# Altium project AVR32DA48_DEwheel2.PrjPcb
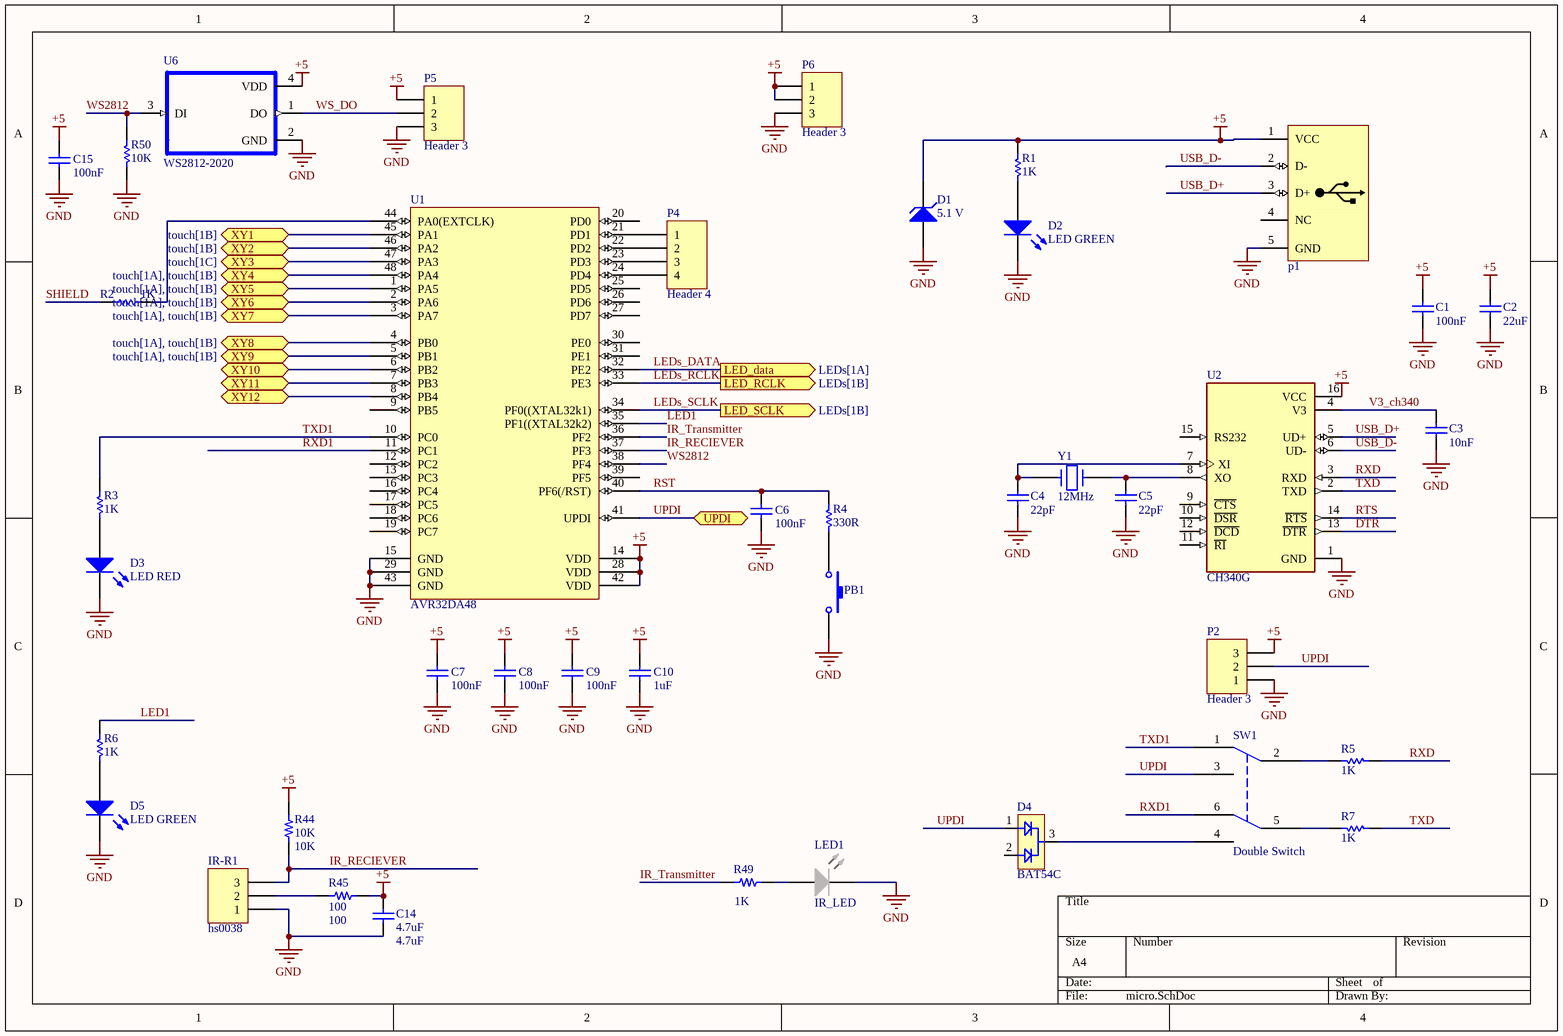
[diagram p0: micro.SchDoc]
3 sheets, 115 parts. Net scope: flat (ports and power ports of the same name join across sheets).
Board file: QTouch_test2.PcbDoc
Sheets:
  micro.SchDoc
  touch.SchDoc
  LEDs.SchDoc

## Sheet micro.SchDoc
size A4; SheetNumber: 1; SheetTotal: 3

### Parts
C1  100nF  [SMD_CAP_0805]
C2  22uF  [SMD_CAP_0805]
C3  10nF  [SMD_CAP_0805]
C4  22pF  [SMD_CAP_0805]
C5  22pF  [SMD_CAP_0805]
C6  value 100nF  [CAP0805]  (hidden comment: cap 100nF)
C7  value 100nF  [CAP0805]  (hidden comment: cap 100nF)
C8  value 100nF  [CAP0805]  (hidden comment: cap 100nF)
C9  value 100nF  [CAP0805]  (hidden comment: cap 100nF)
C10  value 1uF  [CAP0805]  (hidden comment: cap 1uF)
C14  4.7uF  [CAP0805]
C15  value 100nF  [CAP0805]  (hidden comment: cap 100nF)
D1  Voltage: 5.1 V  [Diode 1n4148 SMD]  (hidden comment: Diode Zener)
D2  LED GREEN  [LED_0805 G]
D3  LED RED  [LED_0805 G]
D4  BAT54C  [SOT-23]
D5  LED GREEN  [LED_0805 G]
IR-R1  hs0038  [HS3800B]
LED1  IR_LED  [LED_WHITE]
p1  USB Connector  [USB_AB_BM_SHS]  (value not drawn)
P2  Header 3  [HDR1X3]
P4  Header 4  [HDR1X4]
P5  Header 3  [HDR1X3]
P6  Header 3  [HDR1X3]
PB1  Push-Button-tall  [tack-sw-3x5x6]  (value not drawn)
R1  value 1K  [RES0805]  (hidden comment: Res 1K)
R2  1K  [RES 0805 (2012X06L)]
R3  value 1K  [RES0805]  (hidden comment: Res 1K)
R4  value 330R  [RES0805]  (hidden comment: Res 330R)
R5  value 1K  [RES0805]  (hidden comment: Res 1K)
R6  value 1K  [RES0805]  (hidden comment: Res 1K)
R7  value 1K  [RES0805]  (hidden comment: Res 1K)
R44  10K  [RES0805]
R45  100  [RES0805]
R49  1K  [RES0805]
R50  value 10K  [RES0805]  (hidden comment: Res 10K)
SW1  Double Switch  [switch_2way_DPDT_right]
U1  AVR32DA48  [TQPF48]
U2  CH340G  [SOIC16_N]
U6  WS2812-2020  [LED_WS2812B-5050]
Y1  12MHz  [XTAL_SMD]

### Ports
LED_data (out, see LEDs[1A]), LED_RCLK (out, see LEDs[1B]), LED_SCLK (out, see LEDs[1B]), UPDI (bidir), XY1 (bidir, see touch[1B]), XY2 (bidir, see touch[1B]), XY3 (bidir, see touch[1C]), XY4 (bidir, see touch[1A], touch[1B]), XY5 (bidir, see touch[1A], touch[1B]), XY6 (bidir, see touch[1A], touch[1B]), XY7 (bidir, see touch[1A], touch[1B]), XY8 (bidir, see touch[1A], touch[1B]), XY9 (bidir, see touch[1A], touch[1B]), XY10 (bidir), XY11 (bidir), XY12 (bidir)

### Nets
+5: C1.2 C2.2 C7.2 C8.2 C9.2 C10.2 C14.2 C15.2 D1.2(K) p1.1(VCC) P2.3 P5.1 P6.1 P6.2 R1.1 R44.1 R45.1 U1.14(VDD) U1.28(VDD) U1.42(VDD) U2.16(VCC) U6.4(VDD)
GND: C1.1 C2.1 C3.1 C4.1 C5.1 C6.1 C7.1 C8.1 C9.1 C10.1 C14.1 C15.1 D1.1(A) D2.2(K) D3.2(K) D5.2(K) IR-R1.1 LED1.K p1.5(GND) P2.1 P5.3 P6.3 PB1.1 R50.2 U1.15(GND) U1.29(GND) U1.43(GND) U2.1(GND) U6.2(GND)
DTR: U2.13(~{DTR})
IR_RECIEVER: IR-R1.3 R44.2 U1.37(PF3)
IR_Transmitter: R49.2 U1.36(PF2)
LED1: R6.1 U1.35(PF1((XTAL32k2))
LEDs_DATA: U1.32(PE2) ; port LED_data
LEDs_RCLK: U1.33(PE3) ; port LED_RCLK
LEDs_SCLK: U1.34(PF0((XTAL32k1)) ; port LED_SCLK
RST: C6.2 R4.1 U1.40(PF6(/RST))
RTS: U2.14(~{RTS})
RXD: R5.2 U2.3(RXD)
RXD1: SW1.6 U1.11(PC1)
SHIELD: R2.2
TXD: R7.2 U2.2(TXD)
TXD1: R3.1 SW1.1 U1.10(PC0)
UPDI: D4.1 P2.2 SW1.3 U1.41(UPDI) ; port UPDI
USB_D+: p1.3(D+) U2.5(UD+)
USB_D-: p1.2(D-) U2.6(UD-)
V3_ch340: C3.2 U2.4(V3)
WS2812: R50.1 U1.38(PF4) U6.3(DI)
WS_DO: P5.2 U6.1(DO)
NetC4_2: C4.2 U2.7(XI) Y1.1
NetC5_2: C5.2 U2.8(XO) Y1.2
NetD2_1: D2.1(A) R1.2
NetD3_1: D3.1(A) R3.2
NetD4_3: D4.3 SW1.4
NetD5_1: D5.1(A) R6.2
NetIR-R1_2: IR-R1.2 R45.2
NetLED1_A: LED1.A R49.1
NetP4_1: P4.1 U1.21(PD1)
NetP4_2: P4.2 U1.22(PD2)
NetP4_3: P4.3 U1.23(PD3)
NetP4_4: P4.4 U1.24(PD4)
NetPB1_2: PB1.2 R4.2
NetR2_1: R2.1 U1.44(PA0(EXTCLK))
NetR5_1: R5.1 SW1.2
NetR7_1: R7.1 SW1.5
NetR8_2: U1.48(PA4) ; port XY4
NetR9_2: U1.1(PA5) ; port XY5
NetR10_2: U1.2(PA6) ; port XY6
NetR11_2: U1.5(PB1) ; port XY9
NetR12_2: U1.4(PB0) ; port XY8
NetR13_2: U1.3(PA7) ; port XY7
NetR46_2: U1.45(PA1) ; port XY1
NetR47_2: U1.46(PA2) ; port XY2
NetR48_2: U1.47(PA3) ; port XY3
NetU1_6: U1.6(PB2) ; port XY10
NetU1_7: U1.7(PB3) ; port XY11
NetU1_8: U1.8(PB4) ; port XY12

Not connected (* = marked no-connect by the designer): D4 2; p1 4(NC); U1 9(PB5) 12(PC2) 13(PC3) 16(PC4) 17(PC5) 18(PC6) 19(PC7) 20(PD0) 25(PD5) 26(PD6) 27(PD7) 30(PE0) 31(PE1) 39(PF5); U2 9(~{CTS}) 10(~{DSR}) 11(~{RI}) 12(~{DCD}) 15(RS232)

### Library data of the parts
C1-C5 = Cap: CAP SMD 0805; Published: 8-Jun-2000; LatestRevisionDate: 17-Jul-2002; LatestRevisionNote: Re-released for DXP Platform.; PackageReference: RAD-0.3; Publisher: Altium Limited; PackageDescription: Radial Cap, Thru-Hole; 2 Leads; 0.3 in Pin Spacing
  C1: Value: 100nF
  C2: Value: 22uF
  C3: Value: 10nF
  C4 C5: Value: 22pF
C6-C10 C15 = Cap ceramic: CAP seramic
C14 = Cap: CAP SMD 0603; Published: 8-Jun-2000; LatestRevisionDate: 17-Jul-2002; LatestRevisionNote: Re-released for DXP Platform.; PackageReference: RAD-0.3; Publisher: Altium Limited; PackageDescription: Radial Cap, Thru-Hole; 2 Leads; 0.3 in Pin Spacing; Value: 4.7uF
D1 = Diode Zener: Zener Diode; Designer: Saeid Jorablo; Company: E.P.I.L; Design Date: 2011/11/02
D2 D5 = LED0: LED SMD 0805 GREEN; Published: 8-Jun-2000; LatestRevisionDate: 08-Jul-2005; LatestRevisionNote: Mech Layer 1 removed.; PackageReference: LED-0; Publisher: Altium Limited; PackageDescription: LED; 2 Leads
D3 = LED0: LED SMD 0805 RED; Published: 8-Jun-2000; LatestRevisionDate: 08-Jul-2005; LatestRevisionNote: Mech Layer 1 removed.; PackageReference: LED-0; Publisher: Altium Limited; PackageDescription: LED; 2 Leads
IR-R1 = Header 3H: Header, 3-Pin, Right Angle; LatestRevisionDate: 17-Jul-2002; LatestRevisionNote: Re-released for DXP Platform.; Publisher: Altium Limited
LED1 = LED-W
p1 = USB MICRO: USB Connector MICRO-B Type; Designer: ABBAS BASEREH; Max Current: 1600mA; Mounting Technology: Surface Mount\Through-Hole; Category: Connector; Pin Count: 5-7; Publisher: ABBAS BASEREH; Status: Unreleased; ComponentLink1Description: Datasheet; ComponentLink2Description: Reference; Update: 1395-11-17
P2 P5 P6 = Header 3: Header, 3-Pin; LatestRevisionDate: 17-Jul-2002; LatestRevisionNote: Re-released for DXP Platform.; Publisher: Altium Limited
P4 = Header 4: Header, 4-Pin; LatestRevisionDate: 17-Jul-2002; LatestRevisionNote: Re-released for DXP Platform.; Publisher: Altium Limited
R1-R7 R50 = Res1: Resistor; Published: 8-Jun-2000; LatestRevisionDate: 17-Jul-2002; LatestRevisionNote: Re-released for DXP Platform.; PackageReference: AXIAL-0.3; Publisher: Altium Limited; PackageDescription: Axial Device, Thru-Hole; 2 Leads; 0.3 in Pin Spacing
  R2: Value: 1K
R44 R45 R49 = Resistor: RES SMD 0603; Part Number: RCS0805100KFKEA
  R44: Value: 10K
  R45: Value: 100
  R49: Value: 1K
SW1 = Switch - DPDT: DPDT Switch
U2 = CH340G: USB Interface Integrated Circuit; MF: WCH; Price: None; SnapEDA_Link: https://www.snapeda.com/parts/Ch340G/WCH/view-part/?ref=snap; MP: Ch340G; Value: *; Availability: Not in stock; Package: None; Check_prices: https://www.snapeda.com/parts/Ch340G/WCH/view-part/?ref=eda
U6 = WS2812-2020: Intelligent control LED integrated light source; MF: Worldsemi; SnapEDA_Link: https://www.snapeda.com/parts/WS2812-2020/Worldsemi/view-part/2873751/?ref=snap; Package: Package Analog Devices; MP: WS2812-2020; Value: *; Availability: Unavailable; Price: None
Y1 = CRYSTAL

## Sheet touch.SchDoc
size A4; SheetNumber: 2; SheetTotal: 3
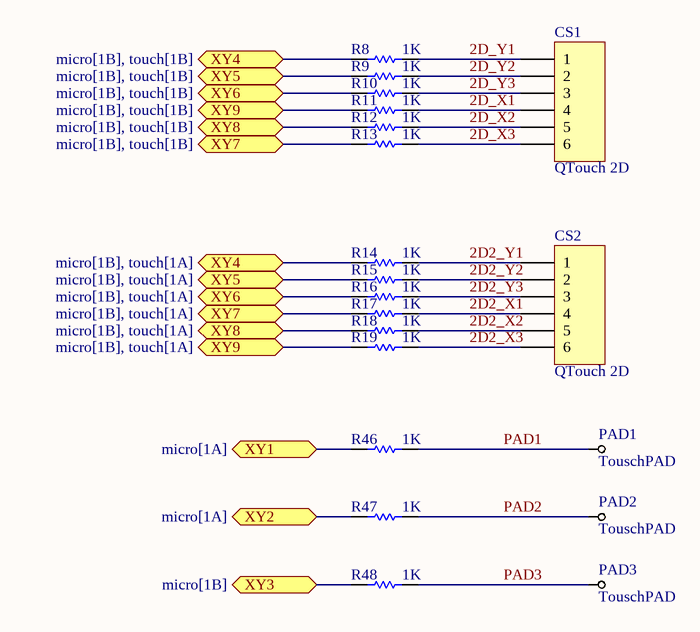
[diagram p1: touch.SchDoc]

### Parts
CS1  QTouch 2D  [wheel]
CS2  QTouch 2D  [2D_touch _wheel]
PAD1  TouschPAD  [touchpad7]  (no BOM)
PAD2  TouschPAD  [touchpad7]  (no BOM)
PAD3  TouschPAD  [touchpad7]  (no BOM)
R8  1K  [RES 0805 (2012X06L)]
R9  1K  [RES 0805 (2012X06L)]
R10  1K  [RES 0805 (2012X06L)]
R11  1K  [RES 0805 (2012X06L)]
R12  1K  [RES 0805 (2012X06L)]
R13  1K  [RES 0805 (2012X06L)]
R14  1K  [RES 0805 (2012X06L)]
R15  1K  [RES 0805 (2012X06L)]
R16  1K  [RES 0805 (2012X06L)]
R17  1K  [RES 0805 (2012X06L)]
R18  1K  [RES 0805 (2012X06L)]
R19  1K  [RES 0805 (2012X06L)]
R46  1K  [RES 0805 (2012X06L)]
R47  1K  [RES 0805 (2012X06L)]
R48  1K  [RES 0805 (2012X06L)]

### Ports
XY1 (bidir, see micro[1A]), XY2 (bidir, see micro[1A]), XY3 (bidir, see micro[1B]), XY4 (bidir, see micro[1B], touch[1A]), XY4 (bidir, see micro[1B], touch[1B]), XY5 (bidir, see micro[1B], touch[1A]), XY5 (bidir, see micro[1B], touch[1B]), XY6 (bidir, see micro[1B], touch[1A]), XY6 (bidir, see micro[1B], touch[1B]), XY7 (bidir, see micro[1B], touch[1A]), XY7 (bidir, see micro[1B], touch[1B]), XY8 (bidir, see micro[1B], touch[1A]), XY8 (bidir, see micro[1B], touch[1B]), XY9 (bidir, see micro[1B], touch[1A]), XY9 (bidir, see micro[1B], touch[1B])

### Nets
2D2_X1: CS2.4 R17.1
2D2_X2: CS2.5 R18.1
2D2_X3: CS2.6 R19.1
2D2_Y1: CS2.1 R14.1
2D2_Y2: CS2.2 R15.1
2D2_Y3: CS2.3 R16.1
2D_X1: CS1.4 R11.1
2D_X2: CS1.5 R12.1
2D_X3: CS1.6 R13.1
2D_Y1: CS1.1 R8.1
2D_Y2: CS1.2 R9.1
2D_Y3: CS1.3 R10.1
PAD1: PAD1.1(T) R46.1
PAD2: PAD2.1(T) R47.1
PAD3: PAD3.1(T) R48.1
NetR8_2: R8.2 R14.2 ; port XY4
NetR9_2: R9.2 R15.2 ; port XY5
NetR10_2: R10.2 R16.2 ; port XY6
NetR11_2: R11.2 R19.2 ; port XY9
NetR12_2: R12.2 R18.2 ; port XY8
NetR13_2: R13.2 R17.2 ; port XY7
NetR46_2: R46.2 ; port XY1
NetR47_2: R47.2 ; port XY2
NetR48_2: R48.2 ; port XY3

### Library data of the parts
CS1 CS2 = Header 6: 3 by 3 2D touch surface; LatestRevisionDate: 17-Jul-2002; LatestRevisionNote: Re-released for DXP Platform.; Publisher: Altium Limited
PAD1-PAD3 = Test Point
R8-R19 R46-R48 = Res1: Resistor; Published: 8-Jun-2000; LatestRevisionDate: 17-Jul-2002; LatestRevisionNote: Re-released for DXP Platform.; PackageReference: AXIAL-0.3; Publisher: Altium Limited; PackageDescription: Axial Device, Thru-Hole; 2 Leads; 0.3 in Pin Spacing; Value: 1K

## Sheet LEDs.SchDoc
size A4; SheetNumber: 3; SheetTotal: 3
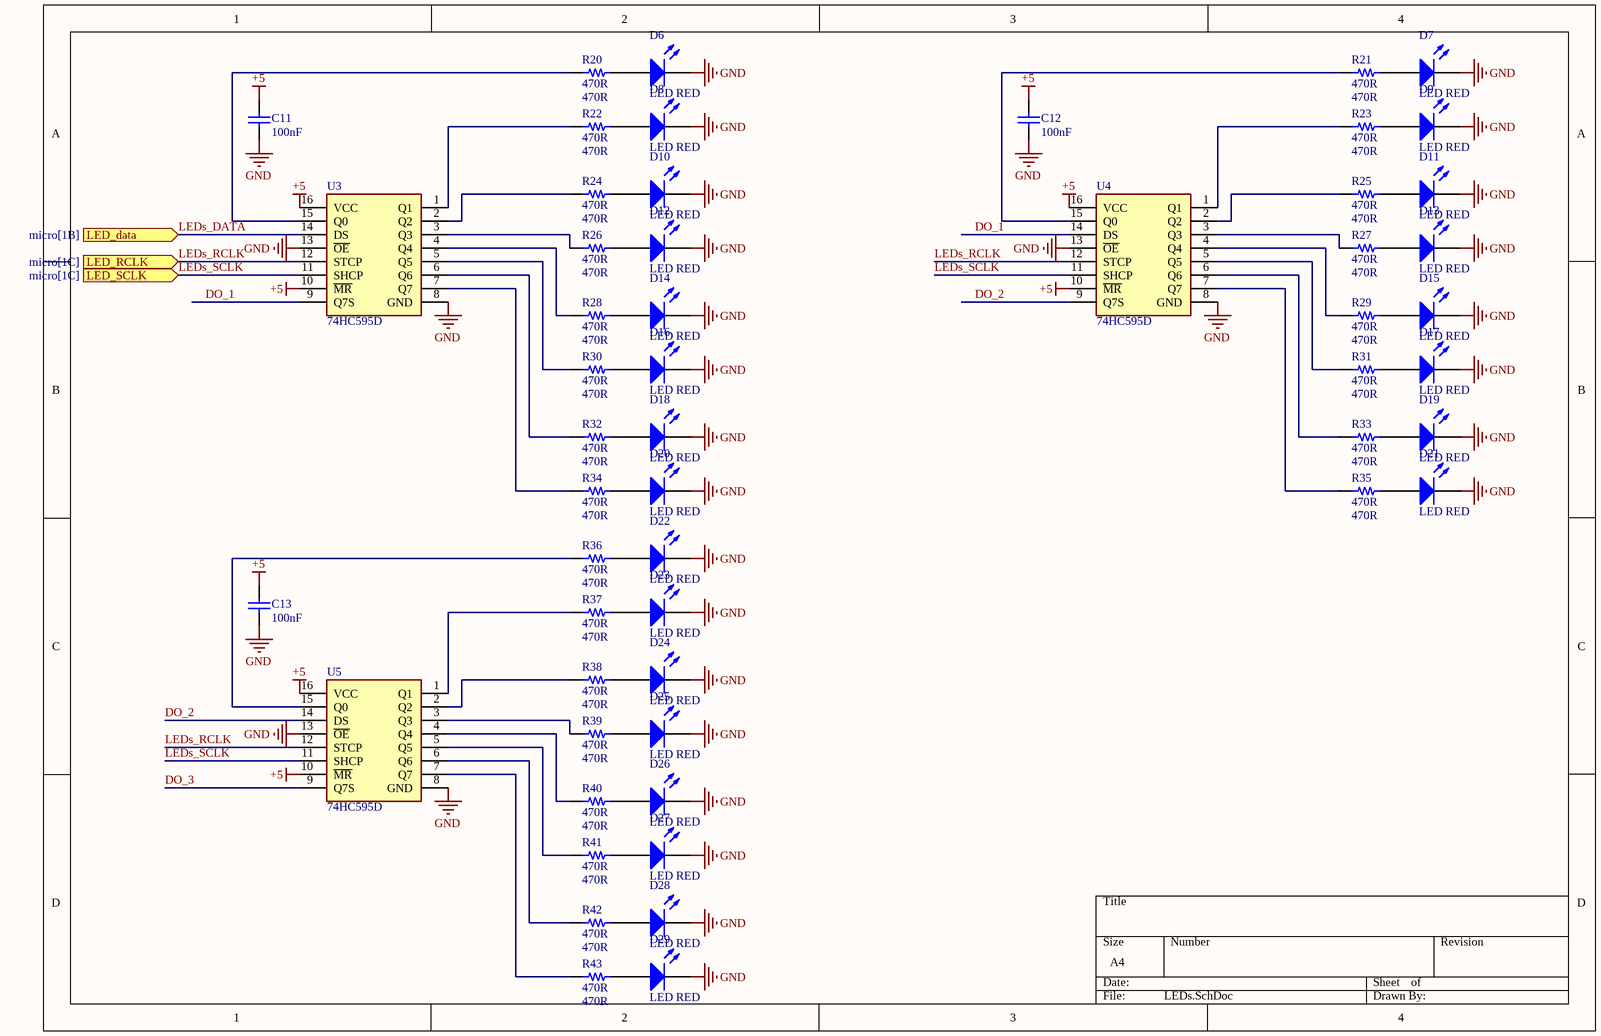
[diagram p2: LEDs.SchDoc]

### Parts
C11  100nF  [SMD_CAP_0805]
C12  100nF  [SMD_CAP_0805]
C13  100nF  [SMD_CAP_0805]
D6  LED RED  [LED_0805 G]
D7  LED RED  [LED_0805 G]
D8  LED RED  [LED_0805 G]
D9  LED RED  [LED_0805 G]
D10  LED RED  [LED_0805 G]
D11  LED RED  [LED_0805 G]
D12  LED RED  [LED_0805 G]
D13  LED RED  [LED_0805 G]
D14  LED RED  [LED_0805 G]
D15  LED RED  [LED_0805 G]
D16  LED RED  [LED_0805 G]
D17  LED RED  [LED_0805 G]
D18  LED RED  [LED_0805 G]
D19  LED RED  [LED_0805 G]
D20  LED RED  [LED_0805 G]
D21  LED RED  [LED_0805 G]
D22  LED RED  [LED_0805 G]
D23  LED RED  [LED_0805 G]
D24  LED RED  [LED_0805 G]
D25  LED RED  [LED_0805 G]
D26  LED RED  [LED_0805 G]
D27  LED RED  [LED_0805 G]
D28  LED RED  [LED_0805 G]
D29  LED RED  [LED_0805 G]
R20  470R  [RES0805]
R21  470R  [RES0805]
R22  470R  [RES0805]
R23  470R  [RES0805]
R24  470R  [RES0805]
R25  470R  [RES0805]
R26  470R  [RES0805]
R27  470R  [RES0805]
R28  470R  [RES0805]
R29  470R  [RES0805]
R30  470R  [RES0805]
R31  470R  [RES0805]
R32  470R  [RES0805]
R33  470R  [RES0805]
R34  470R  [RES0805]
R35  470R  [RES0805]
R36  470R  [RES0805]
R37  470R  [RES0805]
R38  470R  [RES0805]
R39  470R  [RES0805]
R40  470R  [RES0805]
R41  470R  [RES0805]
R42  470R  [RES0805]
R43  470R  [RES0805]
U3  74HC595D  [SOIC127P600X175-16N]
U4  74HC595D  [SOIC127P600X175-16N]
U5  74HC595D  [SOIC127P600X175-16N]

### Ports
LED_data (in, see micro[1B]), LED_RCLK (in, see micro[1C]), LED_SCLK (in, see micro[1C])

### Nets
+5: C11.2 C12.2 C13.2 U3.10(~{MR}) U3.16(VCC) U4.10(~{MR}) U4.16(VCC) U5.10(~{MR}) U5.16(VCC)
GND: C11.1 C12.1 C13.1 D6.2(K) D7.2(K) D8.2(K) D9.2(K) D10.2(K) D11.2(K) D12.2(K) D13.2(K) D14.2(K) D15.2(K) D16.2(K) D17.2(K) D18.2(K) D19.2(K) D20.2(K) D21.2(K) D22.2(K) D23.2(K) D24.2(K) D25.2(K) D26.2(K) D27.2(K) D28.2(K) D29.2(K) U3.8(GND) U3.13(~{OE}) U4.8(GND) U4.13(~{OE}) U5.8(GND) U5.13(~{OE})
DO_1: U3.9(Q7S) U4.14(DS)
DO_2: U4.9(Q7S) U5.14(DS)
DO_3: U5.9(Q7S)
LEDs_DATA: U3.14(DS) ; port LED_data
LEDs_RCLK: U3.12(STCP) U4.12(STCP) U5.12(STCP) ; port LED_RCLK
LEDs_SCLK: U3.11(SHCP) U4.11(SHCP) U5.11(SHCP) ; port LED_SCLK
NetD6_1: D6.1(A) R20.1
NetD7_1: D7.1(A) R21.1
NetD8_1: D8.1(A) R22.1
NetD9_1: D9.1(A) R23.1
NetD10_1: D10.1(A) R24.1
NetD11_1: D11.1(A) R25.1
NetD12_1: D12.1(A) R26.1
NetD13_1: D13.1(A) R27.1
NetD14_1: D14.1(A) R28.1
NetD15_1: D15.1(A) R29.1
NetD16_1: D16.1(A) R30.1
NetD17_1: D17.1(A) R31.1
NetD18_1: D18.1(A) R32.1
NetD19_1: D19.1(A) R33.1
NetD20_1: D20.1(A) R34.1
NetD21_1: D21.1(A) R35.1
NetD22_1: D22.1(A) R36.1
NetD23_1: D23.1(A) R37.1
NetD24_1: D24.1(A) R38.1
NetD25_1: D25.1(A) R39.1
NetD26_1: D26.1(A) R40.1
NetD27_1: D27.1(A) R41.1
NetD28_1: D28.1(A) R42.1
NetD29_1: D29.1(A) R43.1
NetR20_2: R20.2 U3.15(Q0)
NetR21_2: R21.2 U4.15(Q0)
NetR22_2: R22.2 U3.1(Q1)
NetR23_2: R23.2 U4.1(Q1)
NetR24_2: R24.2 U3.2(Q2)
NetR25_2: R25.2 U4.2(Q2)
NetR26_2: R26.2 U3.3(Q3)
NetR27_2: R27.2 U4.3(Q3)
NetR28_2: R28.2 U3.4(Q4)
NetR29_2: R29.2 U4.4(Q4)
NetR30_2: R30.2 U3.5(Q5)
NetR31_2: R31.2 U4.5(Q5)
NetR32_2: R32.2 U3.6(Q6)
NetR33_2: R33.2 U4.6(Q6)
NetR34_2: R34.2 U3.7(Q7)
NetR35_2: R35.2 U4.7(Q7)
NetR36_2: R36.2 U5.15(Q0)
NetR37_2: R37.2 U5.1(Q1)
NetR38_2: R38.2 U5.2(Q2)
NetR39_2: R39.2 U5.3(Q3)
NetR40_2: R40.2 U5.4(Q4)
NetR41_2: R41.2 U5.5(Q5)
NetR42_2: R42.2 U5.6(Q6)
NetR43_2: R43.2 U5.7(Q7)

### Library data of the parts
C11-C13 = Cap: CAP SMD 0805; Published: 8-Jun-2000; LatestRevisionDate: 17-Jul-2002; LatestRevisionNote: Re-released for DXP Platform.; PackageReference: RAD-0.3; Publisher: Altium Limited; PackageDescription: Radial Cap, Thru-Hole; 2 Leads; 0.3 in Pin Spacing; Value: 100nF
D6-D29 = LED0: LED SMD 0805 RED; Published: 8-Jun-2000; LatestRevisionDate: 08-Jul-2005; LatestRevisionNote: Mech Layer 1 removed.; PackageReference: LED-0; Publisher: Altium Limited; PackageDescription: LED; 2 Leads
R20-R43 = Resistor: as R44 on sheet micro; Value: 470R
U3-U5 = 74HC595D: 74HC595 SMD; Manufacturer_Name: Nexperia; Datasheet Link: https://componentsearchengine.com/Datasheets/2/74HC595D.pdf; Height: 1.75mm; Manufacturer_Part_Number: 74HC595D; Mouser Part Number: N/A; Mouser Price/Stock: https://www.mouser.com/Search/Refine.aspx?Keyword=N%2FA

## Nets that join several sheets
+5: micro (22 pins), LEDs (9 pins)
GND: micro (29 pins), LEDs (33 pins)
LEDs_DATA: micro (U1.32), LEDs (U3.14)
LEDs_RCLK: micro (U1.33), LEDs (U3.12 U4.12 U5.12)
LEDs_SCLK: micro (U1.34), LEDs (U3.11 U4.11 U5.11)
NetR8_2: micro (U1.48), touch (R8.2 R14.2)
NetR9_2: micro (U1.1), touch (R9.2 R15.2)
NetR10_2: micro (U1.2), touch (R10.2 R16.2)
NetR11_2: micro (U1.5), touch (R11.2 R19.2)
NetR12_2: micro (U1.4), touch (R12.2 R18.2)
NetR13_2: micro (U1.3), touch (R13.2 R17.2)
NetR46_2: micro (U1.45), touch (R46.2)
NetR47_2: micro (U1.46), touch (R47.2)
NetR48_2: micro (U1.47), touch (R48.2)